# Altium schematic sheet imu.SchDoc
size 420 x 297 mm; Scale: 1:1; DocumentType: Схема электрическая принципиальная; FirstReferrence: АБВГ.123456.001
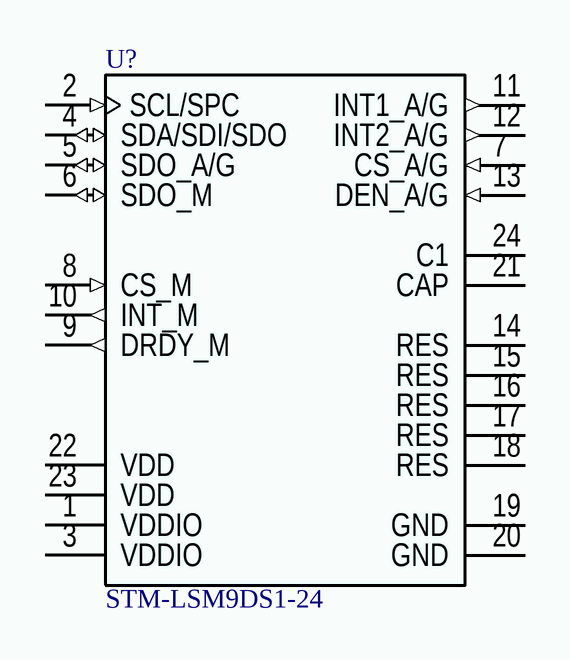
[diagram p0: imu.SchDoc]

## Parts
U?  STM-LSM9DS1-24  [STM-LGA-24_3500X3000X1000]

## Nets

Not connected (* = marked no-connect by the designer): U? 1(VDDIO) 2(SCL/SPC) 3(VDDIO) 4(SDA/SDI/SDO) 5(SDO_A/G) 6(SDO_M) 7(CS_A/G) 8(CS_M) 9(DRDY_M) 10(INT_M) 11(INT1_A/G) 12(INT2_A/G) 13(DEN_A/G) 14(RES) 15(RES) 16(RES) 17(RES) 18(RES) 19(GND) 20(GND) 21(CAP) 22(VDD) 23(VDD) 24(C1)

## Notes on the sheet
- Подп. и дата
- Инв. № дубл.
- Взам. инв. №
- Инв. № подл.
- Изм.
- Лист
- № докум.
- Подп.
- Дата
- 2.106-A3
- Копировал
- Формат А3